# EAGLE design PMW3360-breakout_01 (EAGLE 9.7.0)
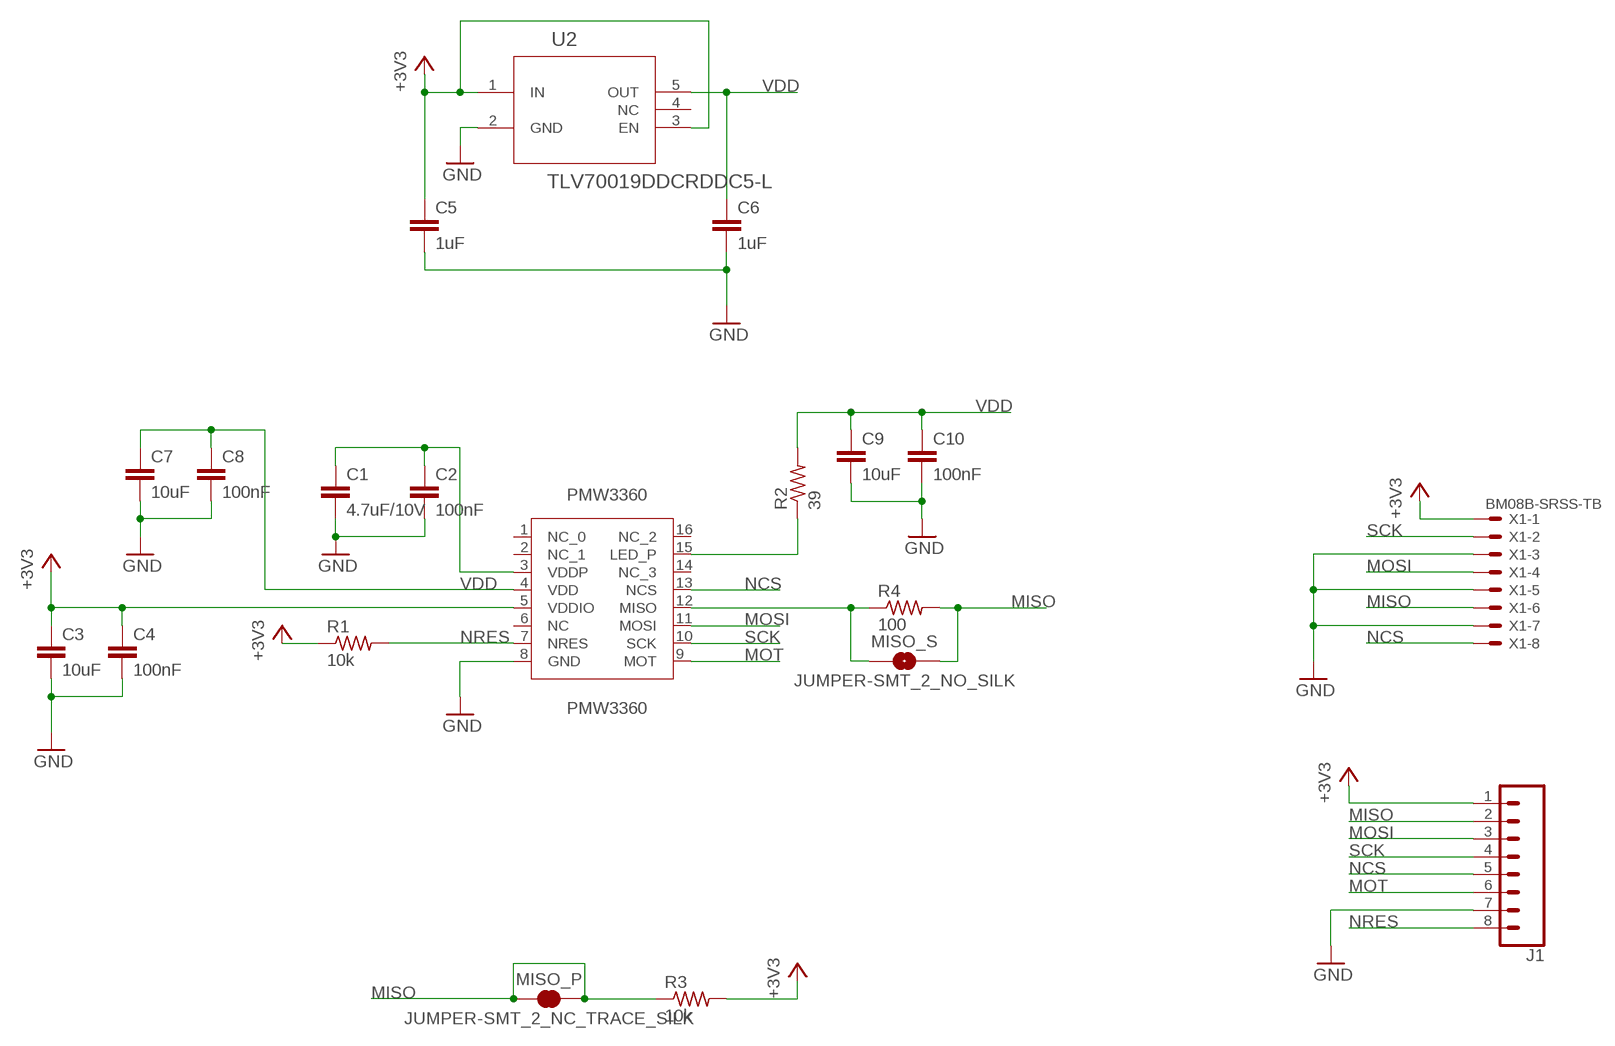
[diagram p0: schematic, sheet 1]

## Parts
C1  4.7uF/10V  C-EUC0603  [C0603]
C2  100nF  C-EUC0402  [C0402]
C3  10uF  C-EUC0402  [C0402]
C4  100nF  C-EUC0402  [C0402]
C5  1uF  C-EUC0402  [C0402]
C6  1uF  C-EUC0402  [C0402]
C7  10uF  C-EUC0402  [C0402]
C8  100nF  C-EUC0402  [C0402]
C9  10uF  C-EUC0402  [C0402]
C10  100nF  C-EUC0402  [C0402]
J1  CONN_08"  [1X08]
MISO_P  JUMPER-SMT_2_NC_TRACE_SILK  [SMT-JUMPER_2_NC_TRACE_SILK]
MISO_S  JUMPER-SMT_2_NO_SILK  [SMT-JUMPER_2_NO_SILK]
PMW3360  PMW3360  [PMW3360]
R1  10k  R-US_R0402  [R0402]
R2  39  R-US_R0402  [R0402]
R3  10k  R-US_R0402  [R0402]
R4  100  R-US_R0402  [R0402]
U2  TLV70019DDCRDDC5-L  [DDC5-L]
X1  BM08B-SRSS-TB  [BM08B-SRSS-TB]

## Nets
+3V3: C3.1 C4.1 C5.1 J1.1 PMW3360.5(VDDIO) R1.1 R3.2 U2.1(IN) U2.3(EN) X1.1
GND: C1.2 C2.2 C3.2 C4.2 C5.2 C6.2 C7.2 C8.2 C9.2 C10.2 J1.7 PMW3360.8(GND) U2.2(GND) X1.3 X1.5 X1.7
MISO: J1.2 MISO_P.1 MISO_P.2 MISO_S.2 R3.1 R4.2 X1.6
MOSI: J1.3 PMW3360.11(MOSI) X1.4
MOT: J1.6 PMW3360.9(MOT)
N$1: PMW3360.15(LED_P) R2.1
N$2: C1.1 C2.1 PMW3360.3(VDDP)
N$3: MISO_S.1 PMW3360.12(MISO) R4.1
NCS: J1.5 PMW3360.13(NCS) X1.8
NRES: J1.8 PMW3360.7(NRES) R1.2
SCK: J1.4 PMW3360.10(SCK) X1.2
VDD: C6.1 C7.1 C8.1 C9.1 C10.1 PMW3360.4(VDD) R2.2 U2.5(OUT)
Unconnected: PMW3360.1(NC_0) PMW3360.2(NC_1) PMW3360.6(NC) PMW3360.14(NC_3) PMW3360.16(NC_2) U2.4(NC)

## Library data of the parts
C1-C10 = rcl:C-EU: CAPACITOR, European symbol; SPICEPREFIX: C
J1 = SparkFun-Connectors:CONN_08: Multi connection point. Often used as Generic Header-pin footprint for 0.1 inch spaced/style header connections On any of the 0.1 inch spaced packages, you can populate with these: Break Away Headers - Straight <https://www.sparkfun.com/products/116> (PRT-00116) Break Away Male Headers - Right Angle <https://www.sparkfun.com/products/553> (PRT-00553) Female Headers <https://www.sparkfun.com/products/115> (PRT-00115) Break Away Headers - Machine Pin <https://www.sparkfun.com/products/117> (PRT-00117) Break Away Female Headers - Swiss Machine Pin <https://www.sparkfun.com/products/743> (PRT-00743) Arduino Stackable Header - 8 Pin <https://www.sparkfun.com/products/9279> (PRT-09279) For SCREWTERMINALS and SPRING TERMINALS visit here: Screw Terimnals on SparkFun.com <https://www.sparkfun.com/search/results?term=Screw+Terminals> (5mm/3.5mm/2.54mm spacing) This device is also useful as a general connection point to wire up your design to another part of your project. Our various solder wires solder well into these plated through hole pads. Hook-Up Wire - Assortment (Stranded, 22 AWG) <https://www.sparkfun.com/products/11375> (PRT-11375) Hook-Up Wire - Assortment (Solid Core, 22 AWG) <https://www.sparkfun.com/products/11367> (PRT-11367) View the entire wire category on our website here <https://www.sparkfun.com/categories/141> Special notes: Molex polarized connector foot print use with SKU : PRT-08231 with associated crimp pins and housings. 1MM SMD Version SKU: PRT-10208 NOTES ON THE VARIANTS LOCK and LOCK_LONGPADS... This footprint was designed to help hold the alignment of a through-hole component (i.e. 6-pin header) while soldering it into place. You may notice that each hole has been shifted either up or down by 0.005 of an inch from it's more standard position (which is a perfectly straight line). This slight alteration caused the pins (the squares in the middle) to touch the edges of the holes. Because they are alternating, it causes a "brace" to hold the component in place. 0.005 has proven to be the perfect amount of "off-center" position when using our standard breakaway headers. Although looks a little odd when you look at the bare footprint, once you have a header in there, the alteration is very hard to notice. Also,if you push a header all the way into place, it is covered up entirely on the bottom side.; PROD_ID: CONN-08438
MISO_P = SparkFun-Jumpers:JUMPER-SMT_2_NC_TRACE: Normally closed trace jumper This jumper has a trace between two pads so it's normally closed (NC). Use a razor knife to open the connection. For best results follow the IPC guidelines for cutting traces: Cutout at least 0.063 mm (0.005 in). Remove all loose material to clean up the cut area. Seal the cut with an approved epoxy. Reapply solder to reclose the connection.
MISO_S = SparkFun-Jumpers:JUMPER-SMT_2_NO: Normally open jumper This jumper has two pads in close proximity to each other. Apply solder to close the connection. Round pads are easier to solder for beginners, but are a lot larger. SparkFun Product that uses the round pads: SparkFun EL Sequencer <https://www.sparkfun.com/products/12781>
PMW3360 = PMW3360:PMW3360
R1-R4 = rcl:R-US_: RESISTOR, American symbol; SPICEPREFIX: R
U2 = TLV70019DDCR:TLV70019DDCR; COPYRIGHT: Copyright (C) 2024 Ultra Librarian. All rights reserved.; MANUFACTURER_PART_NUMBER: TLV70019DDCR; MFR_NAME: Texas Instruments
X1 = con-jst2:?M08B-SRSS-TB: Disconnectable Crimp style connector, 1.0mm pitch 8 contacts

## Board
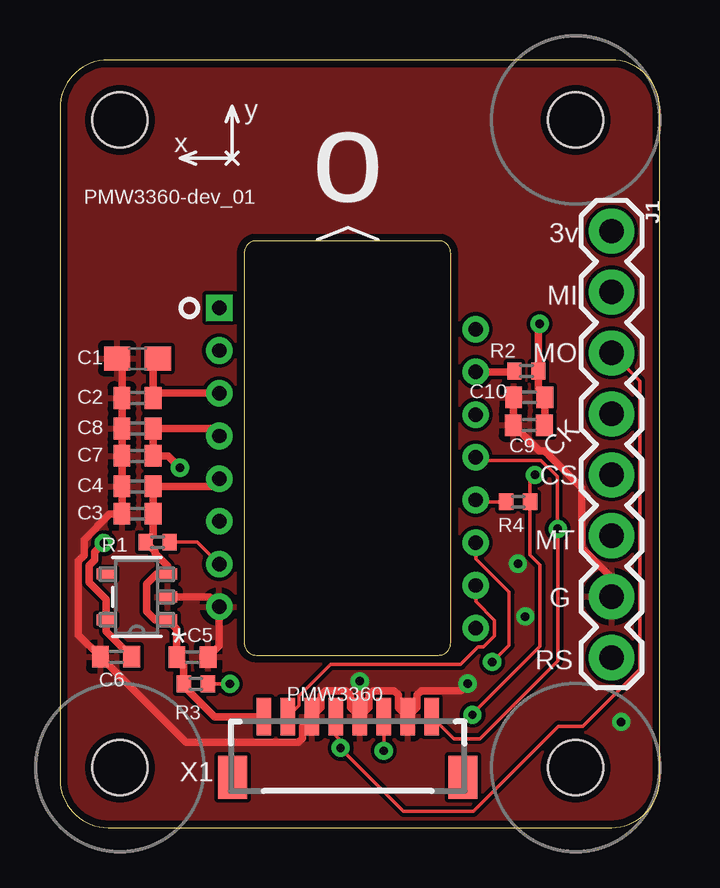
[diagram p1: board, top side]
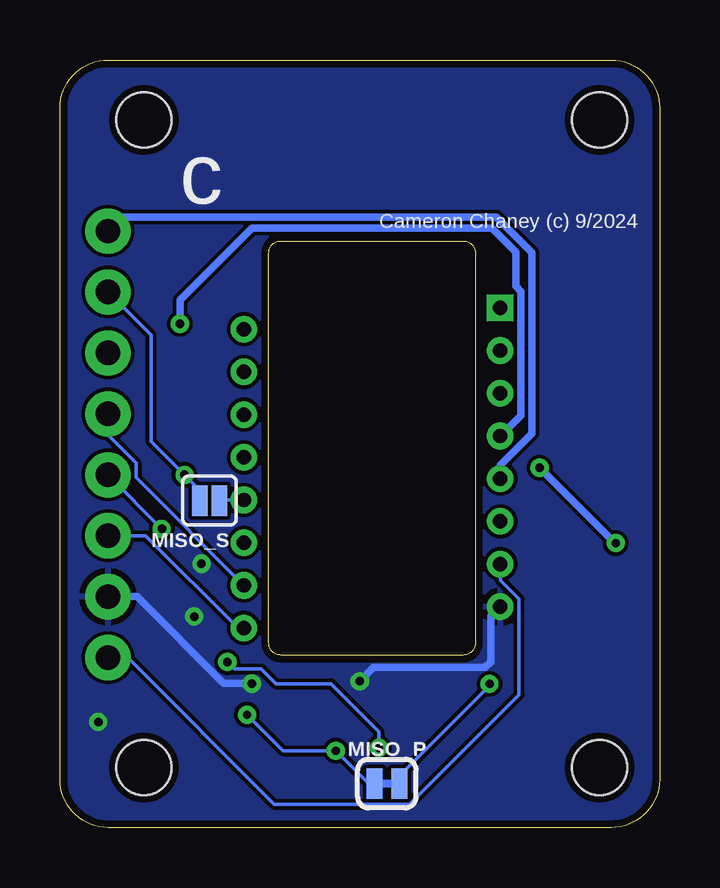
[diagram p2: board, bottom side, seen from below]

Size 25 x 32 mm. Coordinates in mm from the lower left corner, seen from the top.
Outline: 0,30 0,2 arc90 2,0 23,0 arc90 25,2 25,30 arc90 23,32 2,32 arc90 0,30
Copper layers (1*16): Top 0.035mm / dielectric 1.5mm / Bottom 0.035mm
Design rules "Fusion Electronics Design Rules": minimum track width 6mil, minimum drill 0.35mm, track to track 6mil, track to pad 6mil, pad to pad 6mil, via to via 6mil, smd to smd 0mil, copper to edge 0.3mm, drill to drill 0.15mm, minimum pad ring 10mil, minimum via ring 8mil, stop-mask expansion 4mil, vias tented up to drill 0mil, thermal gap 10mil
Holes 2.3 mm at 2.5,2.5 21.5,2.5 21.5,29.5 2.5,29.5

### Footprints (pad centres in the part's own frame; a part is rotated, then mirrored left to right if it is on the bottom)
C0603 = smd 1.1 x 1: 1 -0.85,0; 2 0.85,0
C0402 = smd 0.7 x 0.9: 1 -0.65,0; 2 0.65,0
1X08 = drill 1.016 pad 1.88: 1 0,0; 2 2.54,0; 3 5.08,0; 4 7.62,0; 5 10.16,0; 6 12.7,0; 7 15.24,0; 8 17.78,0
SMT-JUMPER_2_NC_TRACE_SILK = smd 0.66 x 1.27: 1 -0.521,0; 2 0.521,0
SMT-JUMPER_2_NO_SILK = smd 0.635 x 1.27: 1 -0.406,0; 2 0.406,0
PMW3360 = drill 0.6 square: 1 -5.359,5.664 | drill 0.6: 2 -5.359,3.884; 3 -5.359,2.104; 4 -5.359,0.324; 5 -5.359,-1.456; 6 -5.359,-3.236; 7 -5.359,-5.016; 8 -5.359,-6.796; 9 5.334,-7.685; 10 5.334,-5.905; 11 5.334,-4.125; 12 5.334,-2.345; 13 5.334,-0.565; 14 5.334,1.215; 15 5.334,2.995; 16 5.334,4.775
R0402 = smd 0.6 x 0.7: 1 -0.5,0; 2 0.5,0
DDC5-L = smd 0.8 x 0.457: 1 -1.276,0.95; 2 -1.276,0; 3 -1.276,-0.95; 4 1.276,-0.95; 5 1.276,0.95
BM08B-SRSS-TB = smd 0.6 x 1.55: 1 3.5,-1.625; 2 2.5,-1.625; 3 1.5,-1.625; 4 0.5,-1.625; 5 -0.5,-1.625; 6 -1.5,-1.625; 7 -2.5,-1.625; 8 -3.5,-1.625 | smd 1.2 x 1.8: FIT@1 4.8,0.9; FIT@2 -4.8,0.9

### Placement (x,y rotation side)
C1  3.24,19.56 180 top
C2  3.24,17.91 180 top
C3  3.24,13.08 180 top
C4  3.24,14.22 180 top
C5  5.52,7.11 0 top
C6  2.34,7.12 180 top
C7  3.24,15.49 180 top
C8  3.24,16.64 180 top
C9  19.55,16.78 180 top
C10  19.57,17.93 180 top
J1  23,24.87 270 top
MISO_P  11.37,1.84 0 bottom
MISO_S  18.76,13.63 180 bottom
PMW3360  12,16 0 top
R1  4.07,11.9 0 top
R2  19.45,19.03 0 top
R3  5.66,5.99 180 top
R4  19.1,13.58 0 top
U2  3.21,9.62 180 top
X1  12,3 180 top

### Tracks (layer width: path | path; a pad name or v marks a point on that pad's centre or on a via)
+3V3
  Top 0.305: PMW3360.5 6.32,14.22 C4.1 C3.1 3.89,12.21 R1.1 3.97,11.5 3.97,11.42 4.48,10.9 U2.3 4.03,10.57 3.62,10.16 3.62,9.02 3.97,8.66 U2.1 4.87,8.28 C5.1 5.16,6.82 R3.2 5.16,5.91 6.44,4.62 X1.1
  Bottom 0.305: J1.1 22.41,25.46 6.81,25.46 5.33,23.97 5.33,16.43 6.64,15.11 PMW3360.5
GND  (via drill 0.35)
  Top 0.305: U2.2 6.23,9.62 PMW3360.8 6.64,7.58 C5.2 | C1.2 2.59,19.36 C2.2 C8.2 C7.2 C4.2 C3.2 2.6,13.07 2.07,13.07 1,12 1,11.34 0.77,11.11 0.77,8.04 C6.2 5.26,3.54 9.93,3.54 10.11,3.72 10.11,4.23 X1.3 10.89,5.02 10.89,5.53 11.07,5.71 11.93,5.71 12.11,5.53 12.11,5.02 X1.5 | X1.5 12.89,5.02 12.89,5.53 13.07,5.71 13.93,5.71 14.11,5.53 14.11,5 14.48,4.62 X1.7 14.89,5.02 14.89,5.53 15.07,5.71 16.7,5.71 v17,6 | X1.5 v12.5,6.1 | C10.2 18.9,17.91 C9.2 19.98,15.69 20.21,15.69 21.76,14.15 21.76,11.65 23,10.41 J1.7
  Bottom 0.305: PMW3360.8 7.03,8.82 7.03,6.92 7.27,6.67 11.93,6.67 v12.5,6.1 | J1.7 21.79,9.63 18.18,6.02 17.02,6.02 v17,6
  other vias: 19.1,11 19.4,8.8 23.4,4.4
  pour Top: -10.78,-11.86 32.24,-11.86 32.24,34.97 -10.78,34.97
  pour Bottom: -8.24,-9.32 30.97,-9.32 30.97,33.7 -8.24,33.7
MISO  (via drill 0.35)
  Top 0.152: X1.6 v13.5,3.2 | R3.1 v7.09,5.99 | v19.8,14.7 19.6,14.5 R4.2 19.6,11.36 20.01,10.95 20.01,7.55 17.2,4.74 v17.2,4.7
  Bottom 0.152: v7.09,5.99 7.09,5.91 10.85,2.15 MISO_P.2 MISO_P.1 12.13,1.84 v13.5,3.2 15.7,3.2 v17.2,4.7 | J1.2 21.2,20.53 21.2,16.1 v19.8,14.7 19.17,14.07 MISO_S.2
MOSI  (via drill 0.35)
  Top 0.152: X1.4 11.5,3.83 11.7,3.63 v11.7,3.32 11.7,3.3 14.33,0.67 17.23,0.67 20.79,4.23 21.79,4.23 24.17,6.6 24.17,18.62 J1.3 | v18.02,6.9 18.72,7.6 18.72,9.82 17.33,11.2 PMW3360.11
  Bottom 0.152: 17.44,11.77 PMW3360.11 | v11.7,3.32 11.7,4 13.7,6 16,6 16.61,6.61 17.71,6.61 18.01,6.91 v18.02,6.9
MOT
  Bottom 0.152: PMW3360.9 17.57,8.32 21.42,12.17 J1.6
N$1
  Top 0.305: R2.1 18.91,19 PMW3360.15
N$2
  Top 0.305: C1.1 3.89,19.36 C2.1 4.09,18.1 PMW3360.3
N$3
  Top 0.152: R4.1 17.41,13.58 PMW3360.12
  Bottom 0.152: PMW3360.12 18.34,13.65 MISO_S.1
NCS  (via drill 0.35)
  Top 0.152: X1.8 16.43,3.7 17.5,3.7 20.75,6.95 v20.75,12.45 20.73,12.48 20.73,14.64 20.06,15.31 17.46,15.31 PMW3360.13
  Bottom 0.152: J1.5 23,14.69 v20.76,12.45 v20.75,12.45
NRES
  Top 0.152: R1.2 5.73,11.9 PMW3360.7
  Bottom 0.152: PMW3360.7 6.64,10.31 5.86,9.53 5.86,5.54 10.42,0.97 16.07,0.97 22.19,7.09 J1.8
SCK
  Top 0.152: X1.2 9.97,5.1 9.97,5.49 11.28,6.81 16.49,6.81 16.5,6.8 16.7,6.8 17.43,7.53 17.66,7.53 18.12,7.99 18.12,8.64 17.33,9.42 PMW3360.10
  Bottom 0.152: J1.4 23,16.36 21.83,15.19 21.83,14.59 PMW3360.10
VDD  (via drill 0.35)
  Top 0.305: C6.1 1.93,8.18 U2.5 1.93,9.51 1.23,10.21 1.23,10.92 1.46,11.15 1.46,11.49 v1.82,11.86 | PMW3360.4 6.33,16.64 C8.1 C7.1 4.51,15.49 v5,15 | v20,21 19.95,20.95 R2.2 19.95,18.21 C10.1 20.22,16.8 C9.1
  Bottom 0.305: v5,15 2,12 1.97,12 v1.82,11.86 | PMW3360.4 5.78,17.18 5.78,22.34 6,22.56 6,24 7,25 17,25 20,22 v20,21

### Text on the board
tPlace: y | x | o | PMW3360-dev_01 | 3v | MI | MO | CK | CS | MT | G | RS
bPlace: Cameron Chaney (c) 9/2024 | c